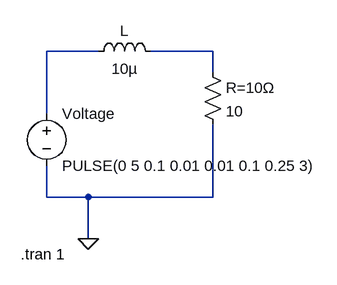
[diagram p0: schematic RL.asc]
RL.asc, the LTspice schematic file:
Version 4
SHEET 1 880 680
WIRE -80 32 -160 32
WIRE 96 32 0 32
WIRE 96 64 96 32
WIRE -160 128 -160 32
WIRE -160 256 -160 208
WIRE -96 256 -160 256
WIRE 96 256 96 144
WIRE 96 256 -96 256
WIRE -96 320 -96 256
FLAG -96 320 0
SYMBOL voltage -160 112 R0
WINDOW 123 0 0 Left 0
WINDOW 39 0 0 Left 0
SYMATTR InstName Voltage
SYMATTR Value PULSE(0 5 0.1 0.01 0.01 0.1 0.25 3)
SYMBOL res 80 48 R0
SYMATTR InstName R=10Ω
SYMATTR Value 10
SYMBOL ind 16 48 M270
WINDOW 0 32 56 VTop 2
WINDOW 3 5 56 VBottom 2
SYMATTR InstName L
SYMATTR Value 10µ
SYMATTR SpiceLine Ipk=0 Rser=0 Rpar=0 Cpar=0
TEXT -200 344 Left 2 !.tran 1

The netlist it stands for:
* RL.asc
Voltage N001 0 PULSE(0 5 0.1 0.01 0.01 0.1 0.25 3)
R=10Ω N002 0 10
L N002 N001 10µ Ipk=0 Rser=0 Rpar=0 Cpar=0
.tran 1
.backanno
.end